# EAGLE design Charger_2023_itr1_ver8 (EAGLE 9.6.2)

## Sheet 1 of 2
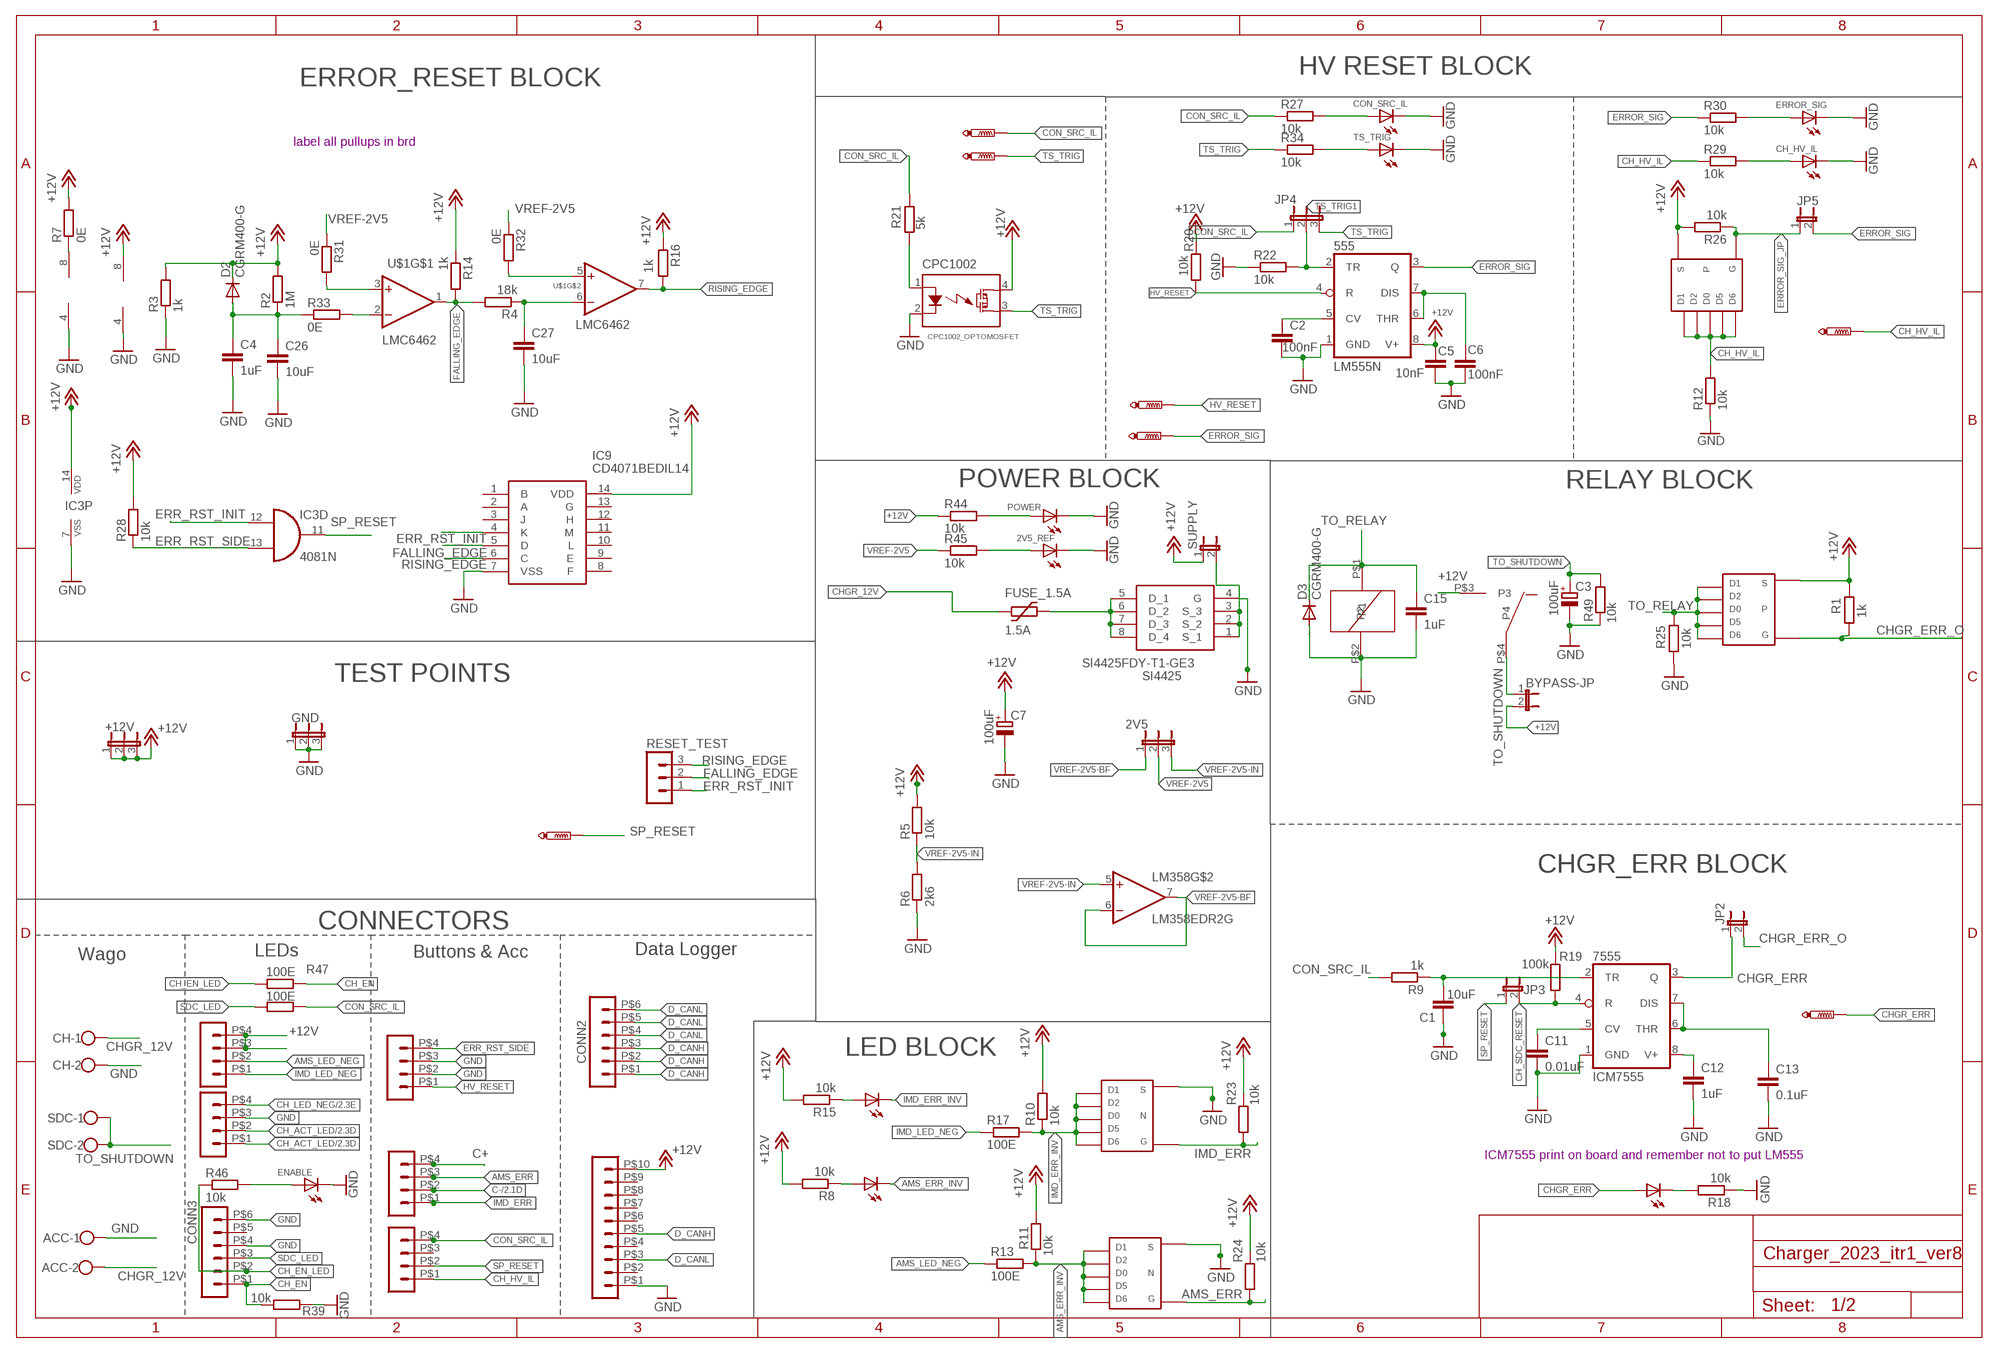
[diagram p0: schematic, sheet 1]

### Parts
2V5  JP2E  [JP2]
2V5_REF  LED-FKIT-1206  [FKIT-LED-1206]
555  LM555N  [DIL08]
7555  ICM7555  LM555N  [DIL08]
+12V  JP2E  [JP2]
ACC  W237-102  [W237-102]
ACU  HEADER_POS4_43045-0412  [43045-0412]
ACU1  HEADER_POS4_43045-0412  [43045-0412]
ACU2  HEADER_POS4_43045-0412  [43045-0412]
ACU3  HEADER_POS4_43045-0412  [43045-0412]
ACU4  HEADER_POS4_43045-0412  [43045-0412]
AMS  LED-FKIT-1206  [FKIT-LED-1206]
BYPASS-JP  JP1E  [JP1]
C1  10uF  C-EUC0805  [C0805]
C2  100nF  C-EUC0805  [C0805]
C3  100uF  CPOL-EUE2.5-6  [E2,5-6]
C4  1uF  C-EUC0805  [C0805]
C5  10nF  C-EUC0805  [C0805]
C6  100nF  C-EUC0805  [C0805]
C7  100uF  CPOL-EUE2.5-6  [E2,5-6]
C11  0.01uF  C-EUC0805  [C0805]
C12  1uF  C-EUC0805  [C0805]
C13  0.1uF  C-EUC0805  [C0805]
C15  1uF  C-EUC0805  [C0805]
C26  10uF  C-EUC0805  [C0805]
C27  10uF  C-EUC0805  [C0805]
CH  W237-102  [W237-102]
CH-HV-IL  PTR1PAD1-13  [P1-13]
CH_HV_IL  LED-FKIT-1206  [FKIT-LED-1206]
CHGR-ERR  PTR1PAD1-13  [P1-13]
CHGR_ERR  LED-FKIT-1206  [FKIT-LED-1206]
CON-SRC-IL  PTR1PAD1-13  [P1-13]
CON_SRC_IL  LED-FKIT-1206  [FKIT-LED-1206]
CONN2  HEADER_POS6_43045-0612  [43045-0612]
CONN3  HEADER_POS6_43045-0612  [43045-0612]
CPC1002  CPC1002_OPTOMOSFET  [SOP04]
D2  CGRM400-G  [SOD-123_MINI-SMA]
D3  CGRM400-G  [SOD-123_MINI-SMA]
ENABLE  LED-FKIT-1206  [FKIT-LED-1206]
ERROR-SIG  PTR1PAD1-13  [P1-13]
ERROR_SIG  LED-FKIT-1206  [FKIT-LED-1206]
FUSE_1.5A  1.5A  1206L  [1206L]
GND  JP2E  [JP2]
HV-RESET  PTR1PAD1-13  [P1-13]
IC3  4081N  [DIL14]
IC9  CD4071BEDIL14  [DIL14]
IMD  LED-FKIT-1206  [FKIT-LED-1206]
JP2  JP1E  [JP1]
JP3  JP1E  [JP1]
JP4  JP2E  [JP2]
JP5  JP1E  [JP1]
LM358  LM358EDR2G  [SOIC-8]
POWER  LED-FKIT-1206  [FKIT-LED-1206]
R1  1k  R-EU_R0805  [R0805]
R2  1M  R-EU_R0805  [R0805]
R3  1k  R-EU_R0805  [R0805]
R4  18k  R-EU_R0805  [R0805]
R5  10k  R-EU_R0805  [R0805]
R6  2k6  R-EU_R0805  [R0805]
R7  0E  R-EU_R0805  [R0805]
R8  10k  R-EU_R0805  [R0805]
R9  1k  R-EU_R0805  [R0805]
R10  10k  R-EU_R0805  [R0805]
R11  10k  R-EU_R0805  [R0805]
R12  10k  R-EU_R0805  [R0805]
R13  100E  R-EU_M0805  [M0805]
R14  1k  R-EU_R0805  [R0805]
R15  10k  R-EU_R0805  [R0805]
R16  1k  R-EU_R0805  [R0805]
R17  100E  R-EU_M0805  [M0805]
R18  10k  R-EU_R0805  [R0805]
R19  100k  R-EU_R0805  [R0805]
R20  10k  R-EU_R0805  [R0805]
R21  5k  R-EU_R0805  [R0805]
R22  10k  R-EU_R0805  [R0805]
R23  10k  R-EU_R0805  [R0805]
R24  10k  R-EU_R0805  [R0805]
R25  10k  R-EU_R0805  [R0805]
R26  10k  R-EU_R0805  [R0805]
R27  10k  R-EU_R0805  [R0805]
R28  10k  R-EU_R0805  [R0805]
R29  10k  R-EU_R0805  [R0805]
R30  10k  R-EU_R0805  [R0805]
R31  0E  R-EU_R0805  [R0805]
R32  0E  R-EU_R0805  [R0805]
R33  0E  R-EU_R0805  [R0805]
R34  10k  R-EU_R0805  [R0805]
R39  10k  R-EU_R0805  [R0805]
R44  10k  R-EU_R0805  [R0805]
R45  10k  R-EU_R0805  [R0805]
R46  10k  R-EU_R0805  [R0805]
R47  100E  R-EU_R0805  [R0805]
R48  100E  R-EU_R0805  [R0805]
R49  10k  R-EU_R0805  [R0805]
RESET_TEST  MA03-1  [MA03-1]
SDC  W237-102  [W237-102]
SI4425  SI4425FDY-T1-GE3  [SOIC127P600X175-8N]
SP_RESET  PTR1PAD1-13  [P1-13]
SUPPLY  JP1E  [JP1]
TS-TRIG  PTR1PAD1-13  [P1-13]
TS_TRIG  LED-FKIT-1206  [FKIT-LED-1206]
U$1  LMC6462  [S08]
U$3  TSOP-6_PMOS  [TSOP-6_PMOS]
U$5  TSOP-6_NMOS  [TSOP-6_NMOS]
U$7  TSOP-6_NMOS  [TSOP-6_NMOS]
U$8  TSOP-6_PMOS  [TSOP-6_PMOS]
U$9  G6DN_RELAY  [G6DN_RELAY]
X5  HEADER_POS10_43045-1012  [43045-1012]

### Nets
+12V: 555.8(V+) 7555.8(V+) +12V.1 +12V.2 +12V.3 ACU.P$3 ACU.P$4 BYPASS-JP.2 C5.1 C7.+ C12.1 CPC1002.4 D2.C IC3.14(P:VDD) IC9.14(VDD) LM358.8(V+) R1.2 R2.2 R3.2 R5.2 R7.2 R8.2 R10.2 R11.2 R14.1 R15.2 R16.1 R19.1 R20.2 R23.2 R24.2 R26.2 R28.2 R44.1 SUPPLY.1 U$3.S U$8.S U$9.P$3(P3) X5.P$10 ; also sheet 2
AMS_ERR: ACU3.P$3 R24.1 U$5.G
AMS_ERR_INV: AMS.C R11.1 R13.2 U$5.1 U$5.2 U$5.5 U$5.6 U$5.D(D0)
AMS_LED_NEG: ACU.P$2 R13.1
C+: ACU3.P$4 ; also sheet 2
C-: ACU3.P$2 ; also sheet 2
CH_ACT_LED: ACU2.P$1 ACU2.P$2 ; also sheet 2
CH_EN: CONN3.P$1 R39.2 R47.2
CH_EN_LED: CONN3.P$2 R46.1 R47.1
CH_HV_IL: ACU4.P$1 CH-HV-IL.TP R12.2 R29.1 U$8.1 U$8.2 U$8.5 U$8.6 U$8.D(D0)
CH_LED_NEG: ACU2.P$4 ; also sheet 2
CH_SDC_RESET: 7555.4(R) JP3.2 R19.2
CHGR_12V: ACC.2 CH.1 FUSE_1.5A.P$1
CHGR_ERR: 7555.3(Q) CHGR-ERR.TP CHGR_ERR.A JP2.1
CHGR_ERR_O: JP2.2 R1.1 U$3.G
CON_SRC_IL: ACU4.P$4 CON-SRC-IL.TP JP4.1 R9.2 R21.2 R27.1 R48.2
D_CANH: CONN2.P$1 CONN2.P$2 CONN2.P$3 X5.P$5
D_CANL: CONN2.P$4 CONN2.P$5 CONN2.P$6 X5.P$3
ERR_RST_INIT: IC3.12(D:I0) IC9.4(K) RESET_TEST.1
ERR_RST_SIDE: ACU1.P$4 IC3.13(D:I1) R28.1
ERROR_SIG: 555.3(Q) ERROR-SIG.TP JP5.2 R30.1
ERROR_SIG_JP: JP5.1 R26.1 U$8.G
FALLING_EDGE: IC9.5(D) R4.2 R14.2 RESET_TEST.2 U$1.1(OUT)
GND: 2V5_REF.C 555.1(GND) 7555.1(GND) ACC.1 ACU1.P$2 ACU1.P$3 ACU2.P$3 C1.1 C2.2 C3.- C4.2 C5.2 C6.2 C7.- C11.2 C12.2 C13.2 C15.2 C26.2 C27.2 CH.2 CH_HV_IL.C CON_SRC_IL.C CONN3.P$4 CONN3.P$6 CPC1002.2 D3.A ENABLE.C ERROR_SIG.C GND.1 GND.2 GND.3 IC3.7(P:VSS) IC9.7(VSS) LM358.4(V-) POWER.C R3.1 R6.1 R12.1 R18.1 R22.1 R25.1 R39.1 R49.1 SI4425.4(G) TS_TRIG.C U$1.4(V-) U$5.S U$7.S U$9.P$2(P2) X5.P$1 ; also sheet 2
HV_RESET: 555.4(R) ACU1.P$1 HV-RESET.TP R20.1
IMD_ERR: ACU3.P$1 R23.1 U$7.G
IMD_ERR_INV: IMD.C R10.1 R17.2 U$7.1 U$7.2 U$7.5 U$7.6 U$7.D(D0)
IMD_LED_NEG: ACU.P$1 R17.1
N$1: 7555.2(TR) C1.2 R9.1
N$2: IMD.A R15.1
N$3: 555.5(CV) C2.1
N$4: CHGR_ERR.C R18.2
N$5: R7.1 U$1.8(V+)
N$6: C4.1 C26.1 D2.A R2.1 R33.1
N$7: 555.6(THR) 555.7(DIS) C6.1
N$8: AMS.A R8.1
N$9: CPC1002.1 R21.1
N$10: CON_SRC_IL.A R27.2
N$11: CH_HV_IL.A R29.2
N$12: C27.1 R4.1 U$1.6(-IN)
N$13: ERROR_SIG.A R30.2
N$14: R34.2 TS_TRIG.A
N$16: 7555.5(CV) C11.1
N$18: 7555.6(THR) 7555.7(DIS) C13.1
N$21: SI4425.1(S_1) SI4425.2(S_2) SI4425.3(S_3) SUPPLY.2
N$23: FUSE_1.5A.P$2 SI4425.5(D_1) SI4425.6(D_2) SI4425.7(D_3) SI4425.8(D_4)
N$24: POWER.A R44.2
N$26: 2V5_REF.A R45.2
N$27: ENABLE.A R46.2
N$31: R31.2 U$1.3(+IN)
N$32: R32.2 U$1.5(+IN)
N$33: R33.2 U$1.2(-IN)
RISING_EDGE: IC9.6(C) R16.2 RESET_TEST.3 U$1.7(OUT)
SDC_LED: CONN3.P$3 R48.1
SP_RESET: ACU4.P$2 IC3.11(D:O) JP3.1 SP_RESET.TP
TO_RELAY: C15.1 D3.C R25.2 U$3.1 U$3.2 U$3.5 U$3.6 U$3.D(D0) U$9.P$1(P1)
TO_SHUTDOWN: BYPASS-JP.1 C3.+ R49.2 SDC.1 SDC.2 U$9.P$4(P4)
TS_TRIG: CPC1002.3 JP4.3 R34.1 TS-TRIG.TP
TS_TRIG1: 555.2(TR) JP4.2 R22.2
VREF-2V5: 2V5.2 R31.1 R32.1 R45.1
VREF-2V5-BF: 2V5.1 LM358.6(-IN) LM358.7(OUT)
VREF-2V5-IN: 2V5.3 LM358.5(+IN) R5.1 R6.2
Unconnected: ACU4.P$3 CONN3.P$5 IC3.1(A:I0) IC3.2(A:I1) IC3.3(A:O) IC3.8(C:I0) IC3.9(C:I1) IC3.10(C:O) IC9.1(B) IC9.2(A) IC9.3(J) IC9.8(F) IC9.9(E) IC9.10(L) IC9.11(M) IC9.12(H) IC9.13(G) LM358.1(OUT) LM358.2(-IN) LM358.3(+IN) X5.P$2 X5.P$4 X5.P$6 X5.P$7 X5.P$8 X5.P$9

### Notes on the sheet
- HV RESET BLOCK
- ERROR_RESET BLOCK
- label all pullups in brd
- POWER BLOCK | RELAY BLOCK
- TEST POINTS
- CHGR_ERR BLOCK
- CONNECTORS
- LEDs | Buttons & Acc | Data Logger
- Wago
- LED BLOCK
- ICM7555 print on board and remember not to put LM555

## Sheet 2 of 2
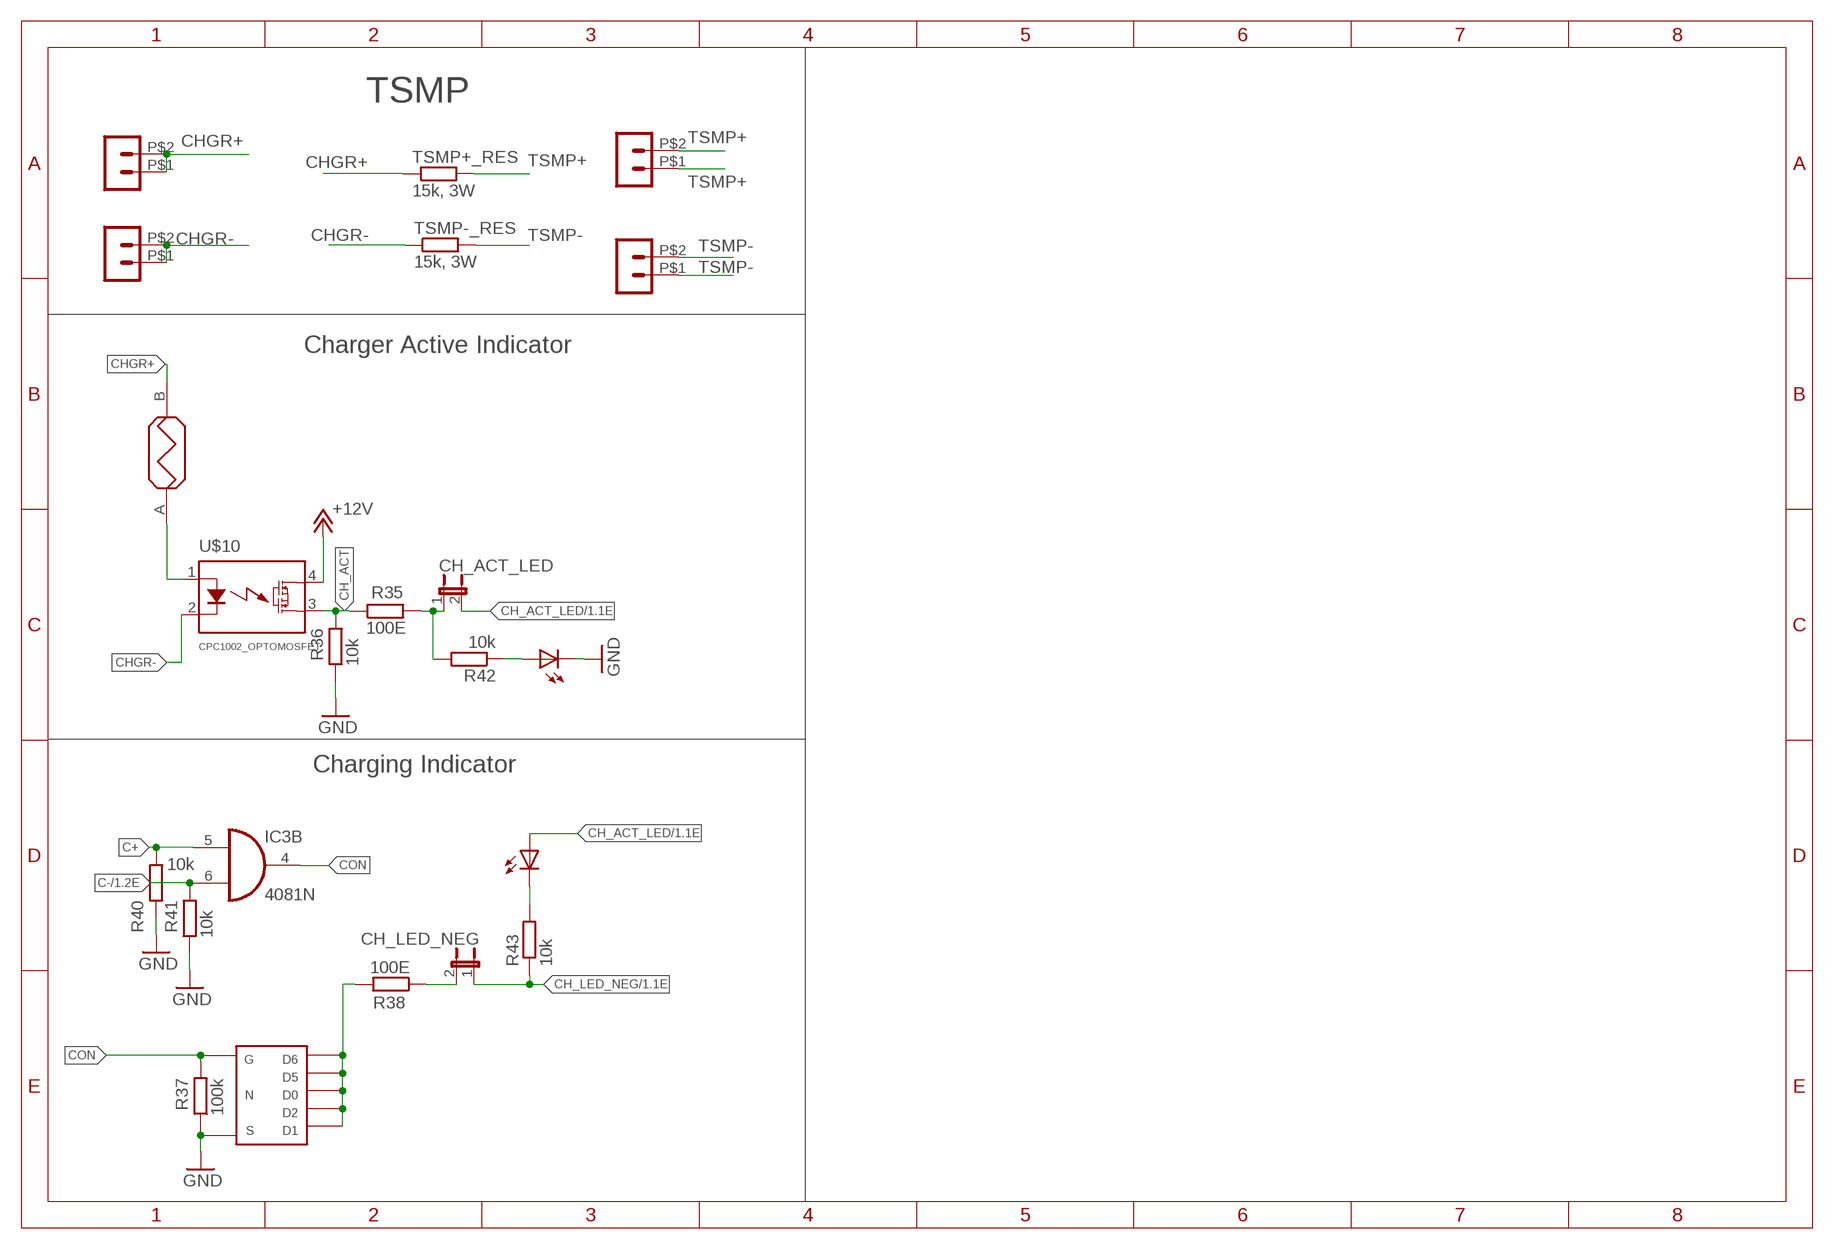
[diagram p1: schematic, sheet 2]

### Parts
CH_ACT  LED-FKIT-1206  [FKIT-LED-1206]
CH_ACT_LED  JP1E  [JP1]
CH_LED_NEG  JP1E  [JP1]
CHARGING  LED-FKIT-1206  [FKIT-LED-1206]
LV_ECU  HEADER_POS2_43045-0212  [43045-0212]
LV_ECU1  HEADER_POS2_43045-0212  [43045-0212]
LV_ECU2  HEADER_POS2_43045-0212  [43045-0212]
LV_ECU3  HEADER_POS2_43045-0212  [43045-0212]
R35  100E  R-EU_M0805  [M0805]
R36  10k  R-EU_M0805  [M0805]
R37  100k  R-EU_M0805  [M0805]
R38  100E  R-EU_M0805  [M0805]
R40  10k  R-EU_M0805  [M0805]
R41  10k  R-EU_M0805  [M0805]
R42  10k  R-EU_R0805  [R0805]
R43  10k  R-EU_R0805  [R0805]
TSMP+_RES  15k, 3W  R-EU_0613/15  [P0613/15]
TSMP-_RES  15k, 3W  R-EU_0613/15  [P0613/15]
U$2_100K10W2  POWER_RESISTOR  [POWER_RESISTOR]
U$10  CPC1002_OPTOMOSFET  [SOP04]
U$12  TSOP-6_NMOS  [TSOP-6_NMOS]

### Nets
+12V: U$10.4 ; also sheet 1
C+: IC3.5(B:I0) R40.2 ; also sheet 1
C-: IC3.6(B:I1) R41.2 ; also sheet 1
CH_ACT: R35.1 R36.2 U$10.3
CH_ACT_LED: CH_ACT_LED.2 CHARGING.A ; also sheet 1
CH_LED_NEG: CH_LED_NEG.1 R43.1 ; also sheet 1
CHGR+: LV_ECU2.P$1 LV_ECU2.P$2 TSMP+_RES.1 U$2_100K10W2.B
CHGR-: LV_ECU3.P$1 LV_ECU3.P$2 TSMP-_RES.1 U$10.2
CON: IC3.4(B:O) R37.2 U$12.G
GND: CH_ACT.C R36.1 R37.1 R40.1 R41.1 U$12.S ; also sheet 1
N$15: CH_ACT.A R42.1
N$17: R38.2 U$12.1 U$12.2 U$12.5 U$12.6 U$12.D(D0)
N$19: CH_LED_NEG.2 R38.1
N$20: CH_ACT_LED.1 R35.2 R42.2
N$22: U$2_100K10W2.A U$10.1
N$25: CHARGING.C R43.2
TSMP+: LV_ECU.P$1 LV_ECU.P$2 TSMP+_RES.2
TSMP-: LV_ECU1.P$1 LV_ECU1.P$2 TSMP-_RES.2

### Notes on the sheet
- TSMP
- Charger Active Indicator
- Charging Indicator

## Library data of the parts
2V5 +12V GND JP4 = jumper:JP2E: JUMPER
2V5_REF AMS CH_ACT CH_HV_IL CHARGING CHGR_ERR CON_SRC_IL ENABLE ERROR_SIG IMD POWER TS_TRIG = IIT_BOMBAY_Racing:LED: LEDs Standard schematic elements and footprints for 5mm, 3mm, 1206, and 0603 sized LEDs. 5mm - Spark Fun Electronics SKU : COM-00529 (and others)
555 7555 = linear:*555: TIMER
ACC CH SDC = IIT_BOMBAY_Racing:W237-102: WAGO SCREW CLAMP; MPN: 237-102; OC_FARNELL: unknown; OC_NEWARK: 70K9898
ACU ACU1-ACU4 = con-molex-micro-fit-3_0:HEADER_POS4_?: Molex - Micro-Fit 3.0 Series connector, 3.00mm (0.118") pitch header, 4 positions.
BYPASS-JP CH_ACT_LED CH_LED_NEG JP2 JP3 JP5 SUPPLY = jumper:JP1E: JUMPER
C1 C2 C4-C6 C11-C13 C15 C26 C27 = IIT_BOMBAY_Racing:C-EU: CAPACITOR, European symbol
C3 C7 = IIT_BOMBAY_Racing:CPOL-EU: POLARIZED CAPACITOR, European symbol
CH-HV-IL CHGR-ERR CON-SRC-IL ERROR-SIG HV-RESET SP_RESET TS-TRIG = testpad:PTR1: TEST PIN
CONN2 CONN3 = con-molex-micro-fit-3_0:HEADER_POS6_?: Molex - Micro-Fit 3.0 Series connector, 3.00mm (0.118") pitch header, 6 positions.
CPC1002 U$10 = IIT_BOMBAY_Racing:CPC1002_OPTOMOSFET: optomosfet for the precharge brd(hv indicator)
D2 D3 = IIT_BOMBAY_Racing:CGRM400*-G: Molded plasitc,JEDEC SOD-123/Mini SMA Source: Comchip CGRM4001-G.pdf
FUSE_1.5A = fuse_1206L:1206L; MFR: Littelfuse; MFR_ID: 1206L175SLYR; PRODUCT_ID: 576-1206L175SLYR
IC3 = 40xx:4081: Quad 2-input AND
IC9 = SamacSys_Parts:CD4071BE: CMOS Quad 2-Input OR Gate Source: Datasheet <http://www.ti.com/lit/ds/symlink/cd4071b.pdf>
LM358 = IIT_BOMBAY_Racing2:LM358EDR2G
LV_ECU LV_ECU1-LV_ECU3 = IIT_BOMBAY_Racing:HEADER_POS2_?: Molex - Micro-Fit 3.0 Series connector, 3.00mm (0.118") pitch header, 2 positions.
R1-R12 R14-R16 R18-R34 R39 R42-R49 = IIT_BOMBAY_Racing:R-EU_: RESISTOR, European symbol
R13 R17 R35-R38 R40 R41 TSMP+_RES TSMP-_RES = rcl:R-EU_: RESISTOR, European symbol; SPICEPREFIX: R
RESET_TEST = con-lstb:MA03-1: PIN HEADER; OC_FARNELL: unknown; OC_NEWARK: unknown
SI4425 = SamacSys_Parts:SI4425FDY-T1-GE3: MOSFET P-CHANNEL 30-V (D-S) MOSFET Source: Datasheet <https://www.vishay.com/docs/77095/si4425fdy.pdf>; DESCRIPTION: MOSFET P-CHANNEL 30-V (D-S) MOSFET; HEIGHT: 1.75mm; MANUFACTURER_NAME: Vishay; MANUFACTURER_PART_NUMBER: SI4425FDY-T1-GE3; MOUSER_PART_NUMBER: 78-SI4425FDY-T1-GE3; MOUSER_PRICE-STOCK: https://www.mouser.co.uk/ProductDetail/Vishay-Siliconix/SI4425FDY-T1-GE3?qs=%252B6g0mu59x7IUQKSn86z1oQ%3D%3D
U$1 = IIT_BOMBAY_Racing:LMC6462
U$2_100K10W2 = IIT_BOMBAY_Racing:POWER_RESISTOR
U$3 = TSOP-6_MOS:TSOP-6_PMOS
U$5 U$7 U$12 = TSOP-6_MOS:TSOP-6_NMOS
U$8 = ACU-MOSFET-updated:TSOP-6_PMOS
U$9 = G6DN_Omron:G6DN_RELAY
X5 = con-molex-micro-fit-3_0:HEADER_POS10_?: Molex - Micro-Fit 3.0 Series connector, 3.00mm (0.118") pitch header, 10 positions.

## Board
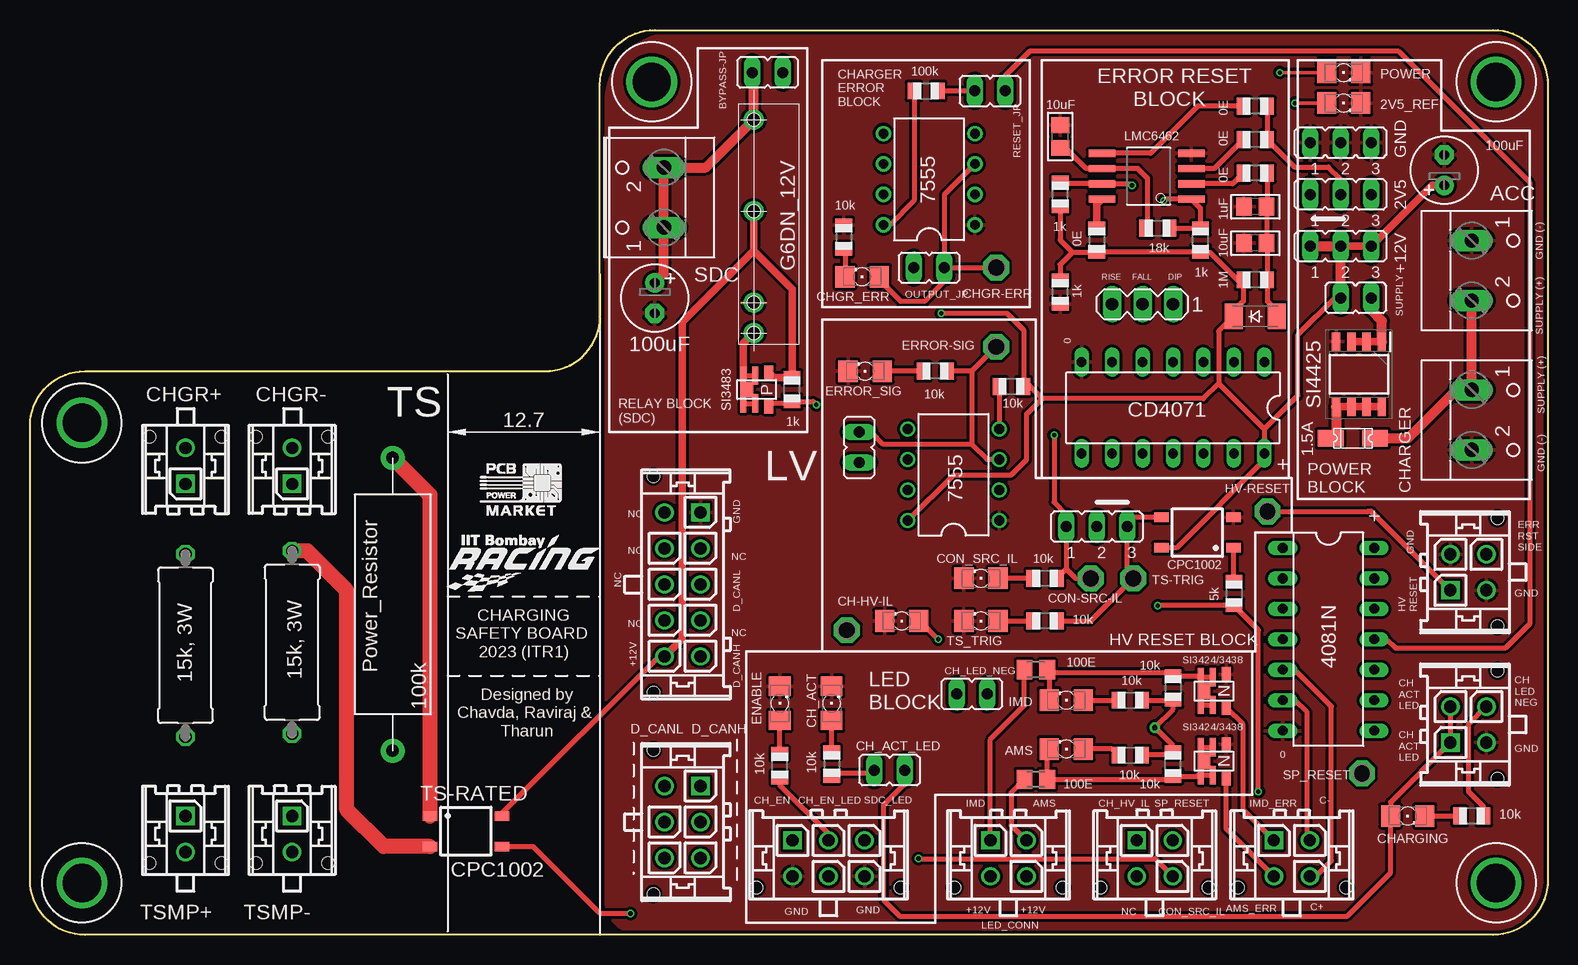
[diagram p2: board, top side]
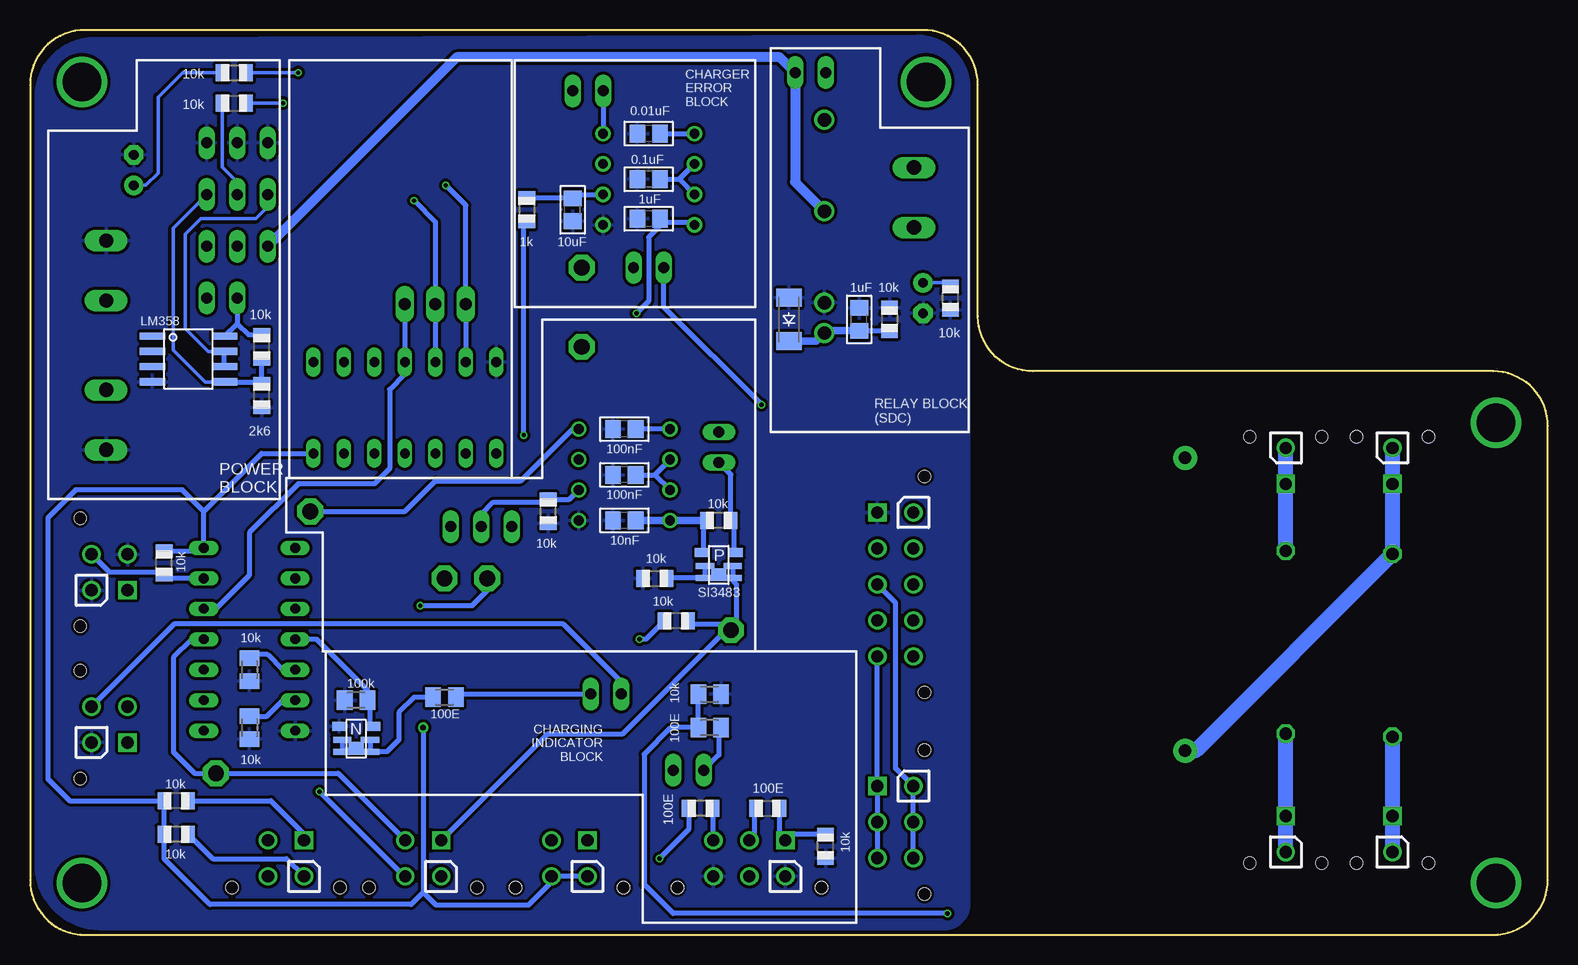
[diagram p3: board, bottom side, seen from below]

Size 126.49 x 75.44 mm. Coordinates in mm from the lower left corner, seen from the top.
Outline: 47.5,51.56 47.5,70.87 arc-90 52.07,75.44 121.92,75.44 arc-90 126.49,70.87 126.49,4.57 arc-90 121.92,0 4.57,0 arc-90 0,4.57 0,42.42 arc-90 4.57,46.99 42.93,46.99 arc90 47.5,51.56
Copper layers (1*16): Top 0.035mm / dielectric 1.5mm / Bottom 0.035mm
Design rules "PCB_Power": minimum track width 5mil, minimum drill 10mil, track to track 5mil, track to pad 5mil, pad to pad 5mil, via to via 5mil, smd to smd 5mil, copper to edge 10mil, drill to drill 6mil, minimum pad ring 5mil, minimum via ring 5mil, stop-mask expansion 3mil, vias tented up to drill 0mil, thermal gap 10mil

### Footprints (pad centres in the part's own frame; a part is rotated, then mirrored left to right if it is on the bottom)
JP2 = drill 0.914 long: 1 -2.54,0; 2 0,0; 3 2.54,0
FKIT-LED-1206 = smd 1.6 x 1.803: A -1.422,0; C 1.422,0
DIL08 = drill 0.813 pad 1.27: 1 -3.81,-3.81; 2 -1.27,-3.81; 3 1.27,-3.81; 4 3.81,-3.81; 5 3.81,3.81; 6 1.27,3.81; 7 -1.27,3.81; 8 -3.81,3.81
W237-102 = drill 1.194 long: 1 -2.5,-1.27; 2 2.5,-1.27
43045-0412 = drill 1.02 square: P$1 1.5,0 | drill 1.02: P$2 -1.5,0; P$3 1.5,3; P$4 -1.5,3 | hole 1.02: 4.5,3.94; -4.5,3.94
JP1 = drill 0.914 long: 1 0,-1.27; 2 0,1.27
C0805 = smd 1.3 x 1.5: 1 -0.95,0; 2 0.95,0
E2,5-6 = drill 0.813 pad 1.6: + -1.27,0 | drill 0.813 pad 1.6 octagon: - 1.27,0
P1-13 = drill 1.321 pad 2.159 octagon: TP 0,0
43045-0612 = drill 1.02 square: P$1 3,0 | drill 1.02: P$2 0,0; P$3 -3,0; P$4 3,3; P$5 0,3; P$6 -3,3 | hole 1.02: 6,3.94; -6,3.94
SOP04 = smd 0.8 x 1.2: 1 -1.27,-3; 2 1.27,-3; 3 1.27,3; 4 -1.27,3
SOD-123_MINI-SMA = smd 1.5 x 2.1: A 1.8,0; C -1.8,0
1206L = smd 2.16 x 1.4: P$1 -1.85,0; P$2 1.85,0
DIL14 = drill 0.813 long: 1 -7.62,-3.81; 2 -5.08,-3.81; 3 -2.54,-3.81; 4 0,-3.81; 5 2.54,-3.81; 6 5.08,-3.81; 7 7.62,-3.81; 8 7.62,3.81; 9 5.08,3.81; 10 2.54,3.81; 11 0,3.81; 12 -2.54,3.81; 13 -5.08,3.81; 14 -7.62,3.81
SOIC-8 = smd 0.6 x 2.1: 1 -1.905,-3; 2 -0.635,-3; 3 0.635,-3; 4 1.905,-3; 5 1.905,3; 6 0.635,3; 7 -0.635,3; 8 -1.905,3
43045-0212 = drill 1.02 square: P$1 0,0 | drill 1.02: P$2 0,3 | hole 1.02: 3,3.94; -3,3.94
R0805 = smd 1.1 x 1.4: 1 -1,0; 2 1,0
M0805 = smd 1.3 x 1.6: 1 -0.95,0; 2 0.95,0
MA03-1 = drill 1.016 long: 1 -2.54,0; 2 0,0; 3 2.54,0
SOIC127P600X175-8N = smd 1.525 x 0.7: 1 -2.712,1.905; 2 -2.712,0.635; 3 -2.712,-0.635; 4 -2.712,-1.905; 5 2.712,-1.905; 6 2.712,-0.635; 7 2.712,0.635; 8 2.712,1.905
P0613/15 = drill 1.016 octagon: 1 -7.62,0; 2 7.62,0
S08 = smd 0.61 x 2.21: 1 -1.905,-3.569; 2 -0.635,-3.569; 3 0.635,-3.569; 4 1.905,-3.569; 5 1.905,3.886; 6 0.635,3.886; 7 -0.635,3.886; 8 -1.905,3.886
POWER_RESISTOR = drill 1.041 pad 2: A 0,23; B 0,-1.41
TSOP-6_PMOS = smd 0.5 x 1.92: 1 -1,-0.96; 6 -1,0.96 | smd 0.5 x 1.52: 2 0,-1.16; 5 0,1.16 | smd 0.635 x 1.27: D -0.5,0 | smd 0.75 x 1.2: G 1.13,-1.4; S 1.13,1.4
TSOP-6_NMOS = smd 0.5 x 1.92: 1 -1,-0.96; 6 -1,0.96 | smd 0.5 x 1.52: 2 0,-1.16; 5 0,1.16 | smd 0.635 x 1.27: D -0.5,0 | smd 0.75 x 1.2: G 1.13,-1.4; S 1.13,1.4
G6DN_RELAY = drill 1.118 pad 1.575: P$1 0.889,3.708; P$2 3.429,3.708; P$3 11.049,3.708; P$4 18.669,3.708
43045-1012 = drill 1.02 square: P$1 6,0 | drill 1.02: P$2 3,0; P$3 0,0; P$4 -3,0; P$5 -6,0; P$6 6,3; P$7 3,3; P$8 0,3; P$9 -3,3; P$10 -6,3 | hole 1.02: 9,3.94; -9,3.94

### Placement (x,y rotation side)
2V5  109.22,61.72 0 top
2V5_REF  109.47,69.34 0 top
555  76.96,38.35 90 top
7555  74.93,62.99 90 top
+12V  109.22,57.4 0 top
ACC  121.41,55.37 270 top
ACU  81.53,7.87 180 top
ACU1  118.36,30.23 270 top
ACU2  118.36,17.53 270 top
ACU3  105.16,7.87 180 top
ACU4  93.73,7.87 180 top
AMS  86.36,15.49 180 top
BYPASS-JP  61.47,71.88 270 top
C1  81.28,60.45 90 bottom
C2  76.96,42.16 180 bottom
C3  52.07,53.09 270 top
C4  102.11,60.71 180 top
C5  76.96,34.54 180 bottom
C6  76.96,38.35 180 bottom
C7  117.86,63.75 90 top
C11  74.93,66.8 180 bottom
C12  74.93,59.69 180 bottom
C13  74.93,62.99 180 bottom
C15  57.4,51.31 90 bottom
C26  102.11,57.66 180 top
C27  85.85,66.55 90 top
CH  121.41,42.93 270 top
CH-HV-IL  68.07,25.4 90 top
CH_ACT  66.8,19.3 90 top
CH_ACT_LED  71.63,13.72 270 top
CH_HV_IL  72.64,26.16 180 top
CH_LED_NEG  78.49,20.07 270 top
CHARGING  114.81,9.91 0 top
CHGR-ERR  80.52,55.63 0 top
CHGR_ERR  69.34,54.86 180 top
CON-SRC-IL  88.39,29.72 0 top
CON_SRC_IL  79.25,29.72 180 top
CONN2  55.88,9.4 90 top
CONN3  66.55,7.87 180 top
CPC1002  97.28,33.53 90 top
D2  102.11,51.56 0 top
D3  63.25,51.31 90 bottom
ENABLE  62.48,19.3 90 top
ERROR-SIG  80.52,49.02 0 top
ERROR_SIG  69.6,46.99 180 top
FUSE_1.5A  110.24,41.4 180 top
GND  109.22,66.04 0 top
HV-RESET  103.12,35.31 0 top
IC3  108.2,24.64 270 top
IC9  95.25,43.94 180 top
IMD  86.36,19.56 180 top
JP2  74.93,55.63 90 top
JP3  80.01,70.36 90 top
JP4  88.9,34.04 0 top
JP5  69.09,40.64 0 top
LM358  113.28,48.01 270 bottom
LV_ECU  12.95,9.91 180 top
LV_ECU1  21.84,9.91 180 top
LV_ECU2  12.95,37.59 0 top
LV_ECU3  21.84,37.59 0 top
POWER  109.47,71.88 0 top
R1  63.5,45.47 90 top
R2  102.11,54.61 180 top
R3  85.85,53.59 90 top
R4  93.98,58.93 0 top
R5  107.19,49.02 90 bottom
R6  107.19,44.96 90 bottom
R7  88.9,57.91 270 top
R8  91.69,14.99 0 top
R9  85.09,60.45 270 bottom
R10  95.25,20.57 270 top
R11  95.25,14.22 90 top
R12  74.42,29.72 0 bottom
R13  83.82,12.95 0 top
R14  97.54,57.91 90 top
R15  91.69,19.56 0 top
R16  85.85,61.72 90 top
R17  83.82,22.1 0 top
R18  67.82,58.17 270 top
R19  74.68,70.36 0 top
R20  81.79,45.72 0 top
R21  100.33,28.45 270 top
R22  83.31,35.31 90 bottom
R23  114.3,11.18 180 bottom
R24  114.3,8.38 180 bottom
R25  54.86,51.31 270 bottom
R26  69.09,34.54 180 bottom
R27  84.58,29.72 180 top
R28  115.32,30.99 90 bottom
R29  72.64,26.16 180 bottom
R30  75.44,46.99 180 top
R31  102.11,66.29 180 top
R32  102.11,69.09 180 top
R33  102.11,63.5 180 top
R34  84.58,26.16 180 top
R35  69.85,17.27 0 bottom
R36  69.85,20.07 180 bottom
R37  99.31,19.56 0 bottom
R38  91.95,19.81 180 bottom
R39  60.2,7.37 90 bottom
R40  108.2,22.1 90 bottom
R41  108.2,17.27 90 bottom
R42  66.8,14.22 270 top
R43  120.14,9.91 180 top
R44  109.47,71.88 0 bottom
R45  109.47,69.34 0 bottom
R46  62.48,14.1 90 top
R47  65.02,10.54 0 bottom
R48  70.61,10.54 180 bottom
R49  49.78,53.09 90 bottom
RESET_TEST  92.71,52.58 180 top
SDC  51.56,61.47 90 top
SI4425  110.74,46.74 270 top
SP_RESET  111,13.46 0 top
SUPPLY  110.49,53.09 270 top
TS-TRIG  91.95,29.72 0 top
TS_TRIG  79.25,26.16 180 top
TSMP+_RES  12.95,24.13 270 top
TSMP-_RES  21.84,24.38 270 top
U$1  93.22,63.25 90 top
U$2  LOGO_PCBPOWER  [270X170]  37.47,34.92 0 top
U$2_100K10W2  30.23,16.76 0 top
U$3  60.45,45.47 0 top
U$4  [RACING_LOGO_190MIL]  34.54,28.45 0 top
U$5  98.55,14.48 0 top
U$7  98.55,20.32 0 top
U$8  69.09,30.73 90 bottom
U$9  64.01,49.28 90 top
U$10  36.32,8.64 270 top
U$12  99.31,16.26 90 bottom
X5  55.88,29.21 90 top

### Tracks (layer width: path | path; a pad name or v marks a point on that pad's centre or on a via)
+12V  (via drill 0.35, 0.45 pad 0.85)
  Top 0.406: 86.87,56.91 85.85,57.93 R16.1 | 86.87,56.91 R7.2 R14.1 98.3,56.91 100.6,54.61 R2.2 101.11,52.83 100.31,52.03 D2.C 99.06,50.31 99.06,45.97 | 102.87,42.16 105.66,44.96 105.66,50.04 108.71,53.09 SUPPLY.1 | 102.87,42.16 IC9.14 102.87,39.58 95.55,32.26 CPC1002.4 | 102.87,42.16 99.06,45.97 | 86.87,56.91 86.87,56.9 85.85,55.88 R3.2 | R19.1 73.68,61.23 71.63,59.18 7555.8 | v75.95,51.82 81.41,51.82 82.8,50.42 82.8,46.24 83.06,45.99 | 83.06,45.99 R20.2 | 99.06,45.97 97.79,44.7 84.34,44.7 | 83.06,45.99 84.34,44.7 | 555.8 76.96,38.35 81.79,38.35 83.06,39.62 83.06,43.42 84.34,44.7 | R8.2 95.01,14.99 R11.2 95.25,15.75 v93.73,17.27 95.25,18.8 95.25,19.56 | 95.25,19.56 R10.2 | R15.2 95.25,19.56 | X5.P$10 52.42,23.21 39.32,10.11 U$10.4
  Top 0.61: U$3.S 61.98,46.47 R1.2 63.5,53.82 60.3,57.02 | +12V.2 +12V.3 116.84,62.48 C7.+ | U$9.P$3 60.3,57.02 | 60.3,57.02 54.36,51.08 54.36,24.69 X5.P$10
  Top 0.813: +12V.1 +12V.2 SUPPLY.1
  Bottom 0.305: C7.+ 116.84,62.48 115.82,63.5 115.82,69.83 113.78,71.88 R44.1
  Bottom 0.406: v93.73,17.27 93.73,3.56 | 93.73,3.56 94.74,2.54 111.51,2.54 115.32,6.35 115.32,8.37 R24.2 R23.2 123.19,11.18 125,12.99 125,34.77 122.68,37.08 113.79,37.08 112.01,35.31 | 93.73,3.56 92.66,2.49 84.91,2.49 83.03,4.37 ACU.P$4 ACU.P$3 | IC9.14 107.19,40.13 112.01,35.31 | U$8.S 70.36,31.99 70.36,34.27 R26.2 | LM358.8 109.22,50.98 | SUPPLY.1 109.22,50.98 | 109.22,50.98 108.27,50.02 R5.2 | 7555.8 71.37,59.44 73.73,59.44 C12.1 73.98,59.12 74.93,58.17 74.93,52.83 v75.95,51.82 | R28.2 112.28,31.99 IC3.14 112.01,35.31
  Bottom 0.61: C5.1 555.8 R26.2
  Bottom 0.813: +12V.1 90.93,73.15 64.01,73.15 BYPASS-JP.2 62.74,62.76 U$9.P$3
AMS_ERR
  Top 0.406: ACU3.P$3 99.68,8.85 U$5.G
  Bottom 0.406: ACU3.P$3 105.13,6.35 111.27,6.35 R24.1
AMS_ERR_INV
  Top 0.406: U$5.1 97.26,13.22 R11.1 94.98,12.95 R13.2 84.77,15.33 AMS.C | U$5.5 97.75,15.64 U$5.6 97.55,14.98 U$5.D 97.55,13.98 U$5.1 | U$5.1 97.75,13.32 U$5.2
AMS_LED_NEG
  Top 0.406: ACU.P$2 81.76,9.14 81.76,11.85 R13.1
C+
  Top 0.406: ACU3.P$4 107.16,4.87 108.46,6.17 108.46,19.05 105.41,22.1 IC3.5
  Bottom 0.406: IC3.5 105.41,22.1 106.68,23.37 107.88,23.37 R40.2
C-
  Top 0.406: ACU3.P$2 106.4,8.13 106.4,18.57 105.41,19.56 IC3.6
  Bottom 0.406: IC3.6 105.41,19.56 106.75,18.22 R41.2
CH_ACT  (via drill 0.35)
  Top 0.406: U$10.3 41.91,7.37 47.5,1.78 v50.04,1.78
  Bottom 0.406: R36.2 R35.1 73.09,17.27 75.31,15.05 75.31,4.19 72.9,1.78 v50.04,1.78
CH_ACT_LED
  Top 0.406: ACU2.P$2 ACU2.P$1 113.39,11.05 CHARGING.A 113.39,5.18 109.75,1.55 72.49,1.55 71.12,2.92 71.12,10.79 72.9,12.57 CH_ACT_LED.2
CH_EN
  Bottom 0.406: R39.2 63.06,8.37 CONN3.P$1 64.01,8.33 64.01,10.53 R47.2
CH_EN_LED
  Top 0.406: R46.1 62.48,12.46 66.55,8.4 CONN3.P$2
  Bottom 0.406: R47.1 66.15,10.41 66.15,8.27 CONN3.P$2
CH_HV_IL
  Bottom 0.406: U$8.2 67.93,29.93 U$8.1 | U$8.5 70.25,29.93 U$8.6 | U$8.1 68.59,29.73 U$8.D 69.59,29.73 U$8.6 | U$8.6 73.41,29.73 R12.2 | ACU4.P$1 83.34,16.76 77.09,16.76 68.45,25.4 CH-HV-IL.TP | U$8.1 67.62,29.23 67.62,25.85 CH-HV-IL.TP | CH-HV-IL.TP 68.58,25.91 71.39,25.91 R29.1
CH_LED_NEG
  Top 0.406: R43.1 121.14,10.68 119.89,11.94 119.89,17.55 ACU2.P$4
  Bottom 0.406: ACU2.P$4 114.48,25.91 82.04,25.91 77.22,21.08 CH_LED_NEG.1
CH_SDC_RESET
  Top 0.406: R19.2 JP3.2
  Bottom 0.406: JP3.2 7555.4
CHGR+
  Bottom 1.27: LV_ECU2.P$2 LV_ECU2.P$1 TSMP+_RES.1 29.35,15.35 U$2_100K10W2.B
CHGR-
  Top 1.27: U$10.2 29.46,7.37 26.42,10.41 26.42,28.7 23.11,32 TSMP-_RES.1
  Bottom 1.27: TSMP-_RES.1 LV_ECU3.P$1 LV_ECU3.P$2
CHGR_12V
  Top 0.813: ACC.2 CH.1 118.87,45.43 114.85,41.4 FUSE_1.5A.P$1
CHGR_ERR
  Top 0.406: 7555.3 76.2,61.72 JP2.1 | JP2.1 CHGR-ERR.TP | CHGR_ERR.A 70.76,54.61 72.54,52.83 74.55,52.83 76.2,54.48 JP2.1
CHGR_ERR_O  (via drill 0.35)
  Top 0.406: U$3.G 61.84,44.32 63.35,44.32 R1.1 65.26,44.47 v65.53,44.2
  Bottom 0.406: JP2.2 73.66,52.32 v65.53,44.2
CON
  Bottom 0.406: IC3.4 102.62,24.64 98.36,20.39 R37.2 98.17,19.36 98.17,17.64 U$12.G
CON_SRC_IL  (via drill 0.35)
  Top 0.406: 86.36,30.5 JP4.1 86.36,35.05 85.34,36.07 v85.34,41.66 | v102.36,11.94 102.36,25.42 R21.2 94,27.45 v93.98,27.43 | 86.36,30.5 R27.1 | 86.36,30.5 87.14,29.72 CON-SRC-IL.TP | ACU4.P$4 93.75,6.35 v74.04,6.35
  Bottom 0.406: CON-SRC-IL.TP 88.39,28.7 89.66,27.43 v93.98,27.43 | ACU4.P$4 95.3,4.87 v102.36,11.94 | R9.2 85.34,59.2 v85.34,41.66 | R48.2 71.61,8.78 v74.04,6.35
D_CANH
  Bottom 0.406: CONN2.P$3 CONN2.P$2 CONN2.P$1 X5.P$5
D_CANL
  Bottom 0.406: CONN2.P$6 CONN2.P$5 CONN2.P$4 54.36,13.87 54.36,27.69 X5.P$3
ERR_RST_INIT
  Bottom 0.406: RESET_TEST.1 IC9.4 95.25,46.74 96.52,45.47 96.52,38.86 97.79,37.59 104.14,37.59 108.2,33.53 108.2,29.97 111,27.18 IC3.12
ERR_RST_SIDE
  Bottom 0.406: IC3.13 115.05,29.72 R28.1 115.55,30.23 119.86,30.23 ACU1.P$4
ERROR_SIG
  Top 0.406: 555.3 79.76,39.62 78.49,40.89 | 78.49,46.99 78.49,40.89 | ERROR-SIG.TP 78.49,46.99 | 78.49,46.99 R30.1 | JP5.2 70.1,41.91 71.12,40.89 78.49,40.89
ERROR_SIG_JP
  Bottom 0.406: JP5.1 68.09,38.37 R26.1 67.83,34.29 67.83,32.01 U$8.G
FALLING_EDGE  (via drill 0.35)
  Top 0.406: R4.2 97.52,58.93 R14.2 97.54,60.59 U$1.1 94.61,61.34 v94.49,61.21
  Bottom 0.406: v94.49,61.21 92.71,59.44 RESET_TEST.2 IC9.5
GND
  pour Top (isolate 0.254): 121.65,74.97 53.85,75.17 arc90 48.01,69.34 48.01,2.79 arc90 50.55,0.25 121.41,0.25 arc90 125.98,4.83 125.98,70.62 arc90
  pour Bottom (isolate 0.254): 121.14,74.72 52.58,74.92 arc90 48.26,70.61 48.26,2.54 arc90 50.29,0.51 120.65,0.51 arc90 125.98,5.84 125.98,69.85 arc90
GND1  (via drill 3.2)
  other vias: 122.17,4.32
GND2  (via drill 3.2)
  other vias: 4.32,4.32
GND3  (via drill 3.2)
  other vias: 51.82,71.12
GND4  (via drill 3.2)
  other vias: 122.17,71.12
GND5  (via drill 3.2)
  other vias: 4.32,42.67
HV_RESET
  Top 0.406: R20.1 80.79,42.18 555.4 | HV-RESET.TP 111.51,35.31 111.78,35.31 ACU1.P$1
  Bottom 0.406: HV-RESET.TP 95.25,35.31 92.71,37.85 85.6,37.85 81.28,42.16 555.4
IMD_ERR
  Top 0.406: ACU3.P$1 101.09,10.44 101.09,17.53 99.7,18.92 U$7.G
  Bottom 0.406: R23.1 106.43,11.18 103.63,8.38 103.63,7.9 ACU3.P$1
IMD_ERR_INV
  Top 0.406: U$7.6 97.75,21.48 U$7.5 | U$7.2 97.75,19.16 U$7.1 97.55,19.82 U$7.D 97.55,20.82 U$7.6 | U$7.6 97.26,21.57 R10.1 94.98,21.84 85.02,21.84 R17.2 84.94,21.93 IMD.C
IMD_LED_NEG
  Top 0.406: ACU.P$1 80.03,16.28 82.87,19.12 R17.1
N$1
  Bottom 0.406: C1.2 81.25,61.44 | 81.25,61.44 80.96,61.72 7555.2 | R9.1 81.26,61.45 81.25,61.44
N$2
  Top 0.406: IMD.A R15.1
N$3
  Bottom 0.406: 555.5 C2.1
N$4
  Top 0.406: R18.2 67.92,57.06 CHGR_ERR.C
N$5
  Top 0.61: R7.1 88.9,60.91 U$1.8
N$6
  Top 0.406: D2.A 103.91,52.03 103.11,52.83 R2.1 103.11,57.61 C26.1 C4.1 103.11,60.76 R33.1
N$7
  Bottom 0.406: C6.1 74.42,38.35 | 555.6 74.42,38.35 | 555.7 74.42,38.35
N$8
  Top 0.406: R8.1 90.19,15.49 AMS.A
N$9
  Top 0.406: R21.1 100.33,32.21 CPC1002.1
N$10
  Top 0.406: R27.2 CON_SRC_IL.A
N$11  (via drill 0.35)
  Top 0.406: v75.69,24.64 74.17,26.16 CH_HV_IL.A
  Bottom 0.406: R29.2 75.17,24.64 v75.69,24.64
N$12
  Top 0.406: R4.1 93.11,59.06 93.11,63.1 92.33,63.88 U$1.6 88.01,63.88 86.29,65.6 C27.1
N$13
  Top 0.406: R30.2 ERROR_SIG.A
N$14
  Top 0.406: TS_TRIG.A R34.2
N$15
  Top 0.406: R42.1 CH_ACT.A
N$16
  Bottom 0.406: C11.1 7555.5
N$17
  Bottom 0.406: R38.2 94.49,19.81 95.76,18.54 95.76,16.26 96.76,15.26 U$12.1 | U$12.5 100.47,15.46 100.42,15.4 | 100.42,15.4 U$12.6 | U$12.2 98.15,15.46 U$12.1 | 100.42,15.4 99.67,15.4 U$12.D 98.81,15.26 U$12.1
N$18
  Bottom 0.406: C13.1 72.39,62.99 | 72.39,62.99 7555.7 | 72.39,62.99 7555.6
N$19
  Bottom 0.406: R38.1 90.74,20.07 CH_LED_NEG.2
N$20
  Top 0.406: CH_ACT_LED.1 70.1,13.46 67.04,13.46 R42.2
  Bottom 0.406: CH_ACT_LED.1 69.09,14.99 69.09,17.08 R35.2
N$21
  Top 0.61: SI4425.3 SI4425.2 SI4425.1
  Top 0.813: SI4425.1 112.65,51.18 111.76,52.07 SUPPLY.2
N$22
  Top 1.27: U$2_100K10W2.A 33.32,36.67 U$10.1
N$23
  Top 0.61: SI4425.8 SI4425.7 SI4425.6 SI4425.5
  Top 0.813: SI4425.5 108.84,41.86 FUSE_1.5A.P$2
N$24  (via drill 0.35)
  Top 0.305: POWER.A v104.14,71.88
  Bottom 0.305: R44.2 v104.14,71.88
N$25
  Top 0.406: CHARGING.C R43.2
N$26  (via drill 0.35)
  Top 0.305: v105.41,69.34 2V5_REF.A
  Bottom 0.305: R45.2 v105.41,69.34
N$27
  Top 0.406: R46.2 ENABLE.A
N$31
  Top 0.406: R31.2 98.7,63.88 U$1.3
N$32
  Top 0.406: R32.2 97.33,69.09 93.4,65.15 U$1.5
N$33
  Top 0.406: R33.2 100.22,62.61 U$1.2
RISING_EDGE  (via drill 0.35)
  Top 0.406: R16.2 85.96,62.61 U$1.7 91.71,62.61 v91.84,62.48
  Bottom 0.406: IC9.6 RESET_TEST.3 90.17,60.81 91.13,61.78 v91.84,62.48
SDC_LED
  Bottom 0.406: CONN3.P$3 69.55,10.48 R48.1
SP_RESET
  Top 0.406: JP3.1 81.28,71.63 83.31,73.66 114.05,73.66 124.97,62.74 124.97,25.91 122.94,23.88 113.79,23.88 113.03,24.64 IC3.11
  Bottom 0.406: IC3.11 113.03,24.64 114.55,23.11 114.55,15.24 112.78,13.46 SP_RESET.TP 100.81,13.46 ACU4.P$2
TO_RELAY
  Top 0.406: U$3.5 59.65,46.63 U$3.6 59.45,45.97 U$3.D 59.45,44.97 U$3.1 59.65,44.31 U$3.2
  Top 0.61: U$9.P$1 59.45,49.32 U$3.6
  Bottom 0.406: C15.1 54.91,50.36 R25.2
  Bottom 0.61: C15.1 60.11,50.36 U$9.P$1 60.96,49.51 D3.C
TO_SHUTDOWN
  Top 0.813: BYPASS-JP.1 60.3,71.78 U$9.P$4 56.32,63.97 SDC.2 SDC.1 52.83,55.12 C3.+
  Bottom 0.305: R49.2 49.78,54.36 C3.+
TS_TRIG
  Top 0.406: CPC1002.3 91.44,34.8 JP4.3 91.44,30.23 TS-TRIG.TP 88.39,26.16 R34.1
TS_TRIG1
  Bottom 0.406: JP4.2 88.9,35.05 87.88,36.07 83.55,36.07 R22.2 81.55,36.31 555.2
TSMP+
  Bottom 1.27: TSMP+_RES.2 LV_ECU.P$1 LV_ECU.P$2
TSMP-
  Bottom 1.27: LV_ECU1.P$2 LV_ECU1.P$1 TSMP-_RES.2
VREF-2V5
  Top 0.406: R32.1 R31.1 105.39,64.01 108.2,64.01 109.22,62.99 2V5.2
  Bottom 0.305: 2V5.2 109.22,62.74 110.49,64.01 110.49,69.33 R45.1
VREF-2V5-BF
  Bottom 0.305: LM358.7 111.63,48.64 113.54,50.55 113.54,58.42 112.27,59.69 107.7,59.69 106.68,60.71 2V5.1
  Bottom 0.406: LM358.6 LM358.7
VREF-2V5-IN
  Bottom 0.305: LM358.5 111.89,46.1 114.55,48.77 114.55,58.93 2V5.3
  Bottom 0.406: R5.1 R6.2 107.33,46.1 LM358.5

### Text on the board
tPlace: CHARGER / ERROR / BLOCK | ERROR RESET / BLOCK | G6DN_12V | RISE | FALL | DIP | 0 | CHGR+ | CHGR- | TS | RELAY BLOCK / (SDC) | + | LV | POWER / BLOCK | CHARGER | 7555 | NC | GND | + | NC | NC | GND | ERR / RST / SIDE | NC | GND | D_CANL | HV / RESET | NC | NC | HV RESET BLOCK | CHARGING / SAFETY BOARD / 2023 (ITR1) | +12V | D_CANH | LED / BLOCK | CH / ACT / LED | CH / LED / NEG | Designed by / Chavda, Raviraj & / Tharun | GND | 0 | CH / ACT / LED | SP_RESET | CH_EN | CH_EN_LED | IMD | AMS | CH_HV_IL | IMD_ERR | C- | CPC1002 | NC | CON_SRC_IL | AMS_ERR | TSMP+ | TSMP- | GND | GND | +12V | +12V | C+ | LED_CONN
bPlace: CHARGER / ERROR / BLOCK | RELAY BLOCK / (SDC) | POWER / BLOCK | CHARGING / INDICATOR / BLOCK